# Altium schematic sheet SCHEM_PDB_OFA.SchDoc
size 1651 x 1651 mm; SheetNumber: 1; SheetTotal: 1
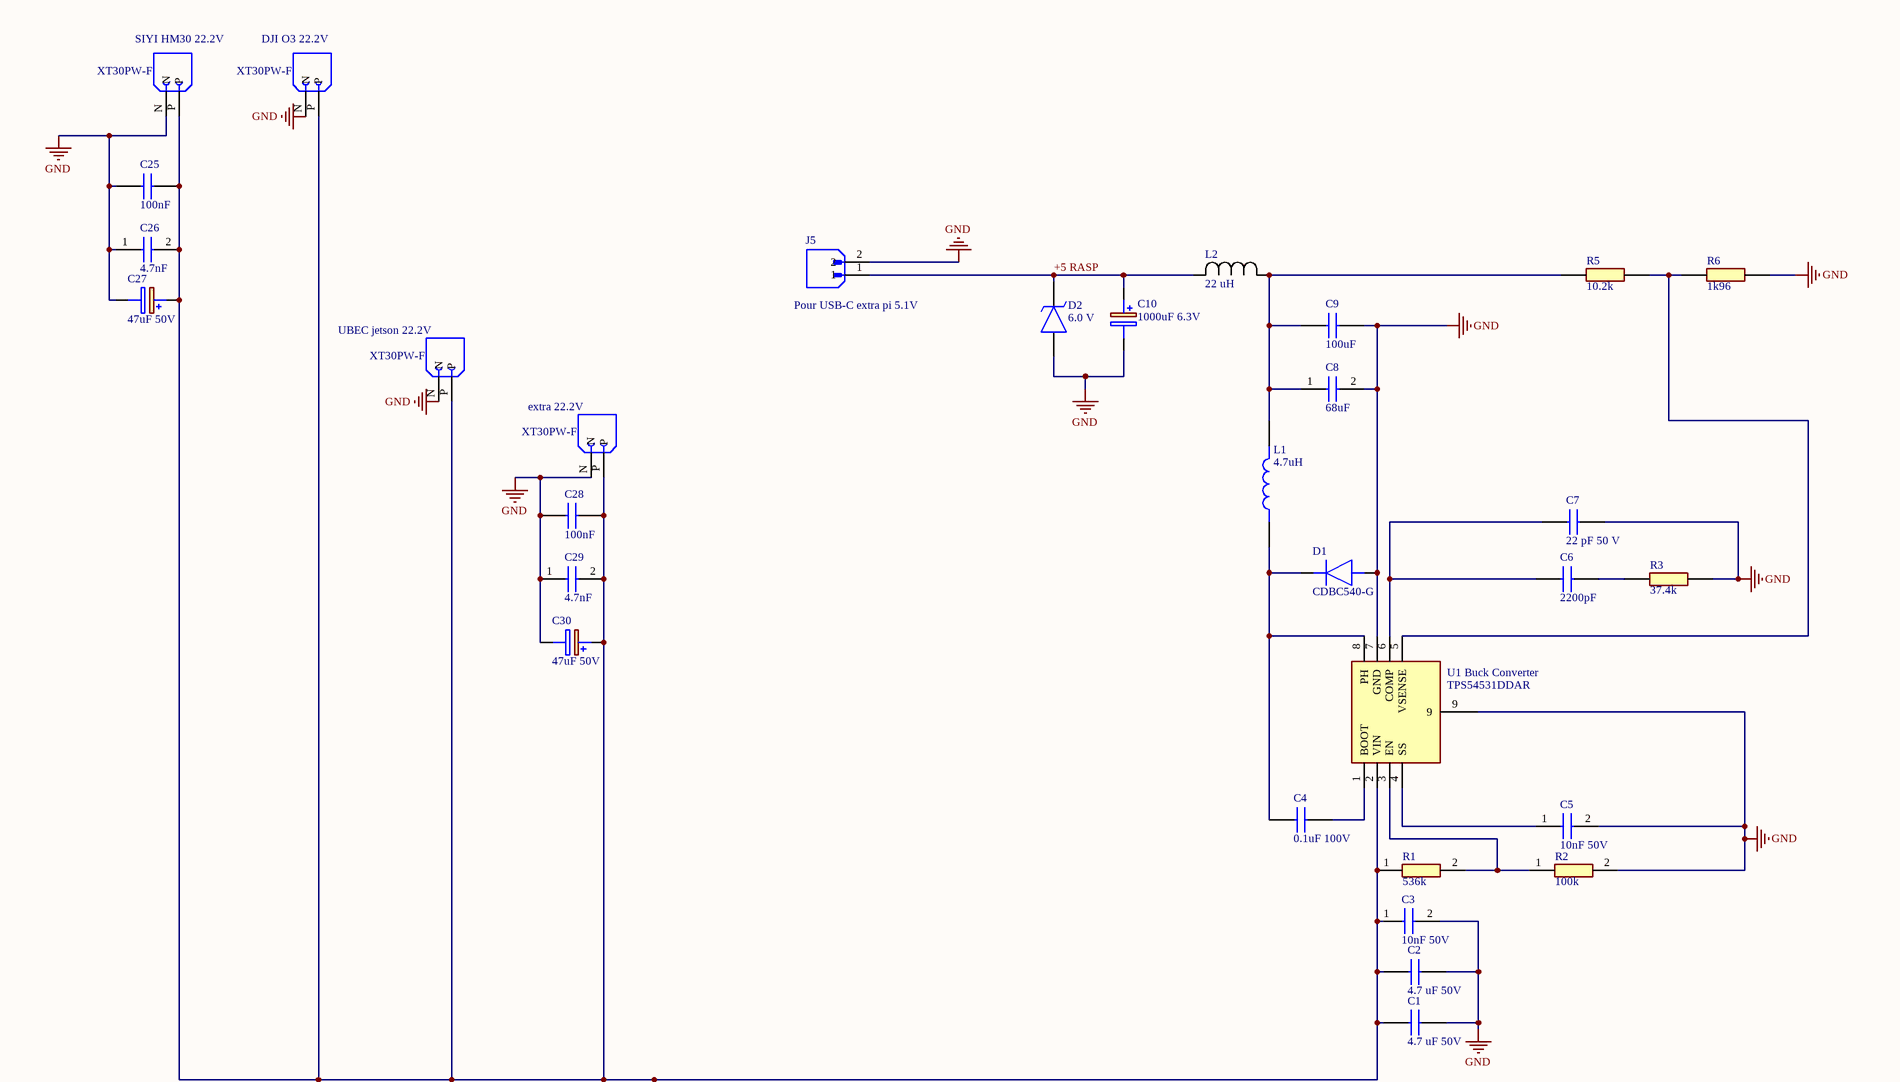
[diagram p0: SCHEM_PDB_OFA.SchDoc, top left]
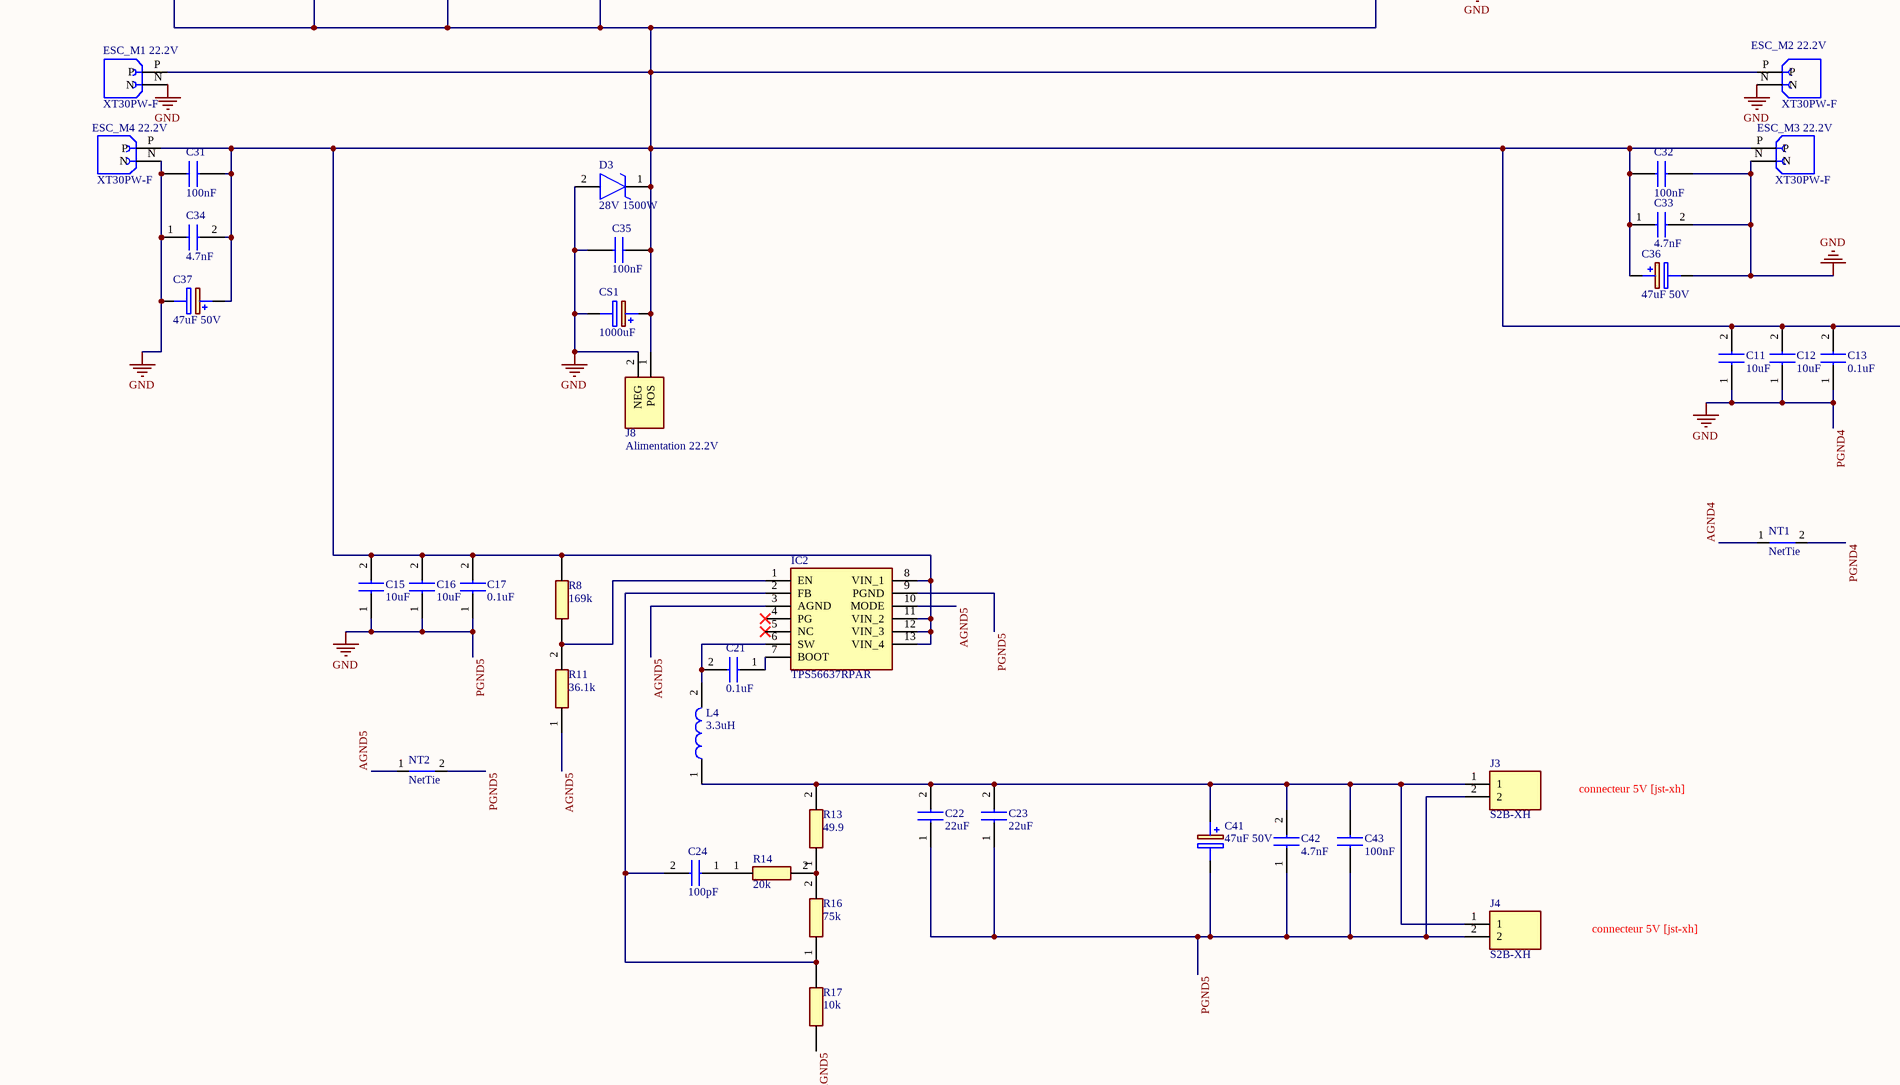
[diagram p1: SCHEM_PDB_OFA.SchDoc, bottom left]
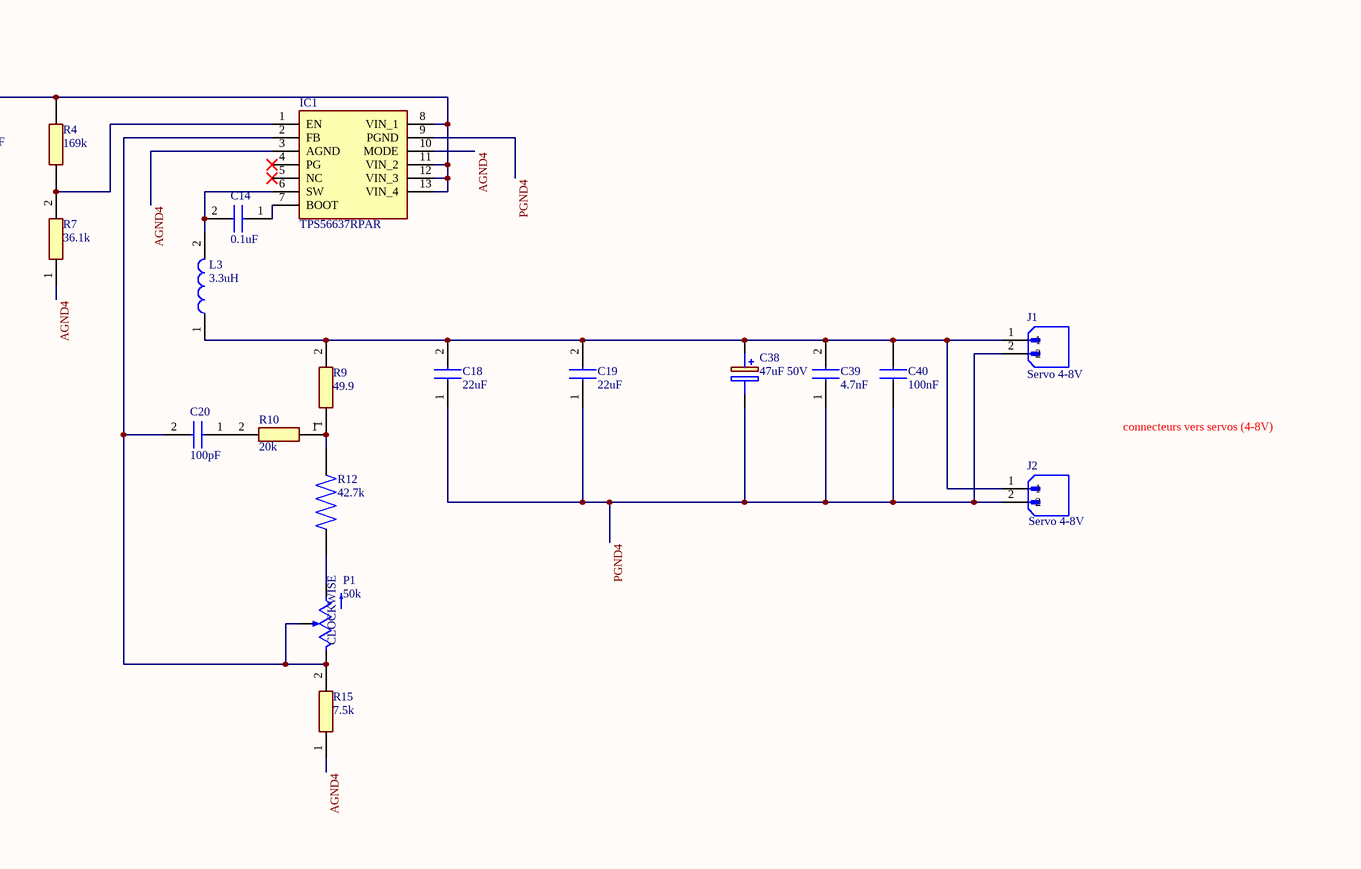
[diagram p2: SCHEM_PDB_OFA.SchDoc, bottom right]

## Parts
C1  4.7 uF 50V  [CAPC2012X145N]
C2  4.7 uF 50V  [CAPC2012X145N]
C3  10nF 50V  [CAPC1608X90N]
C4  0.1uF 100V  [CAPC2012X145N]
C5  10nF 50V  [CAPC1608X90N]
C6  2200pF  [CAPC3216X130N]
C7  22 pF 50 V  [CAPC2012X70N]
C8  68uF  [CAPC3216X180N]
C9  100uF  [GRM31x]
C10  1000uF 6.3V  [CAPAE830X1050N]
C11  10uF  [CAPC3225X280N]
C12  10uF  [CAPC3225X280N]
C13  0.1uF  [C0603]
C14  0.1uF  [C0603]
C15  10uF  [CAPC3225X280N]
C16  10uF  [CAPC3225X280N]
C17  0.1uF  [C0603]
C18  22uF  [CAPC2012X145N]
C19  22uF  [CAPC2012X145N]
C20  100pF  [GRM1885C1H101JA01D]
C21  0.1uF  [C0603]
C22  22uF  [CAPC2012X145N]
C23  22uF  [CAPC2012X145N]
C24  100pF  [GRM1885C1H101JA01D]
C25  100nF  [C1206]
C26  4.7nF  [C1206]
C27  47uF 50V  [CAPPRD250W50D655H1250]
C28  100nF  [C1206]
C29  4.7nF  [C1206]
C30  47uF 50V  [CAPPRD250W50D655H1250]
C31  100nF  [C1206]
C32  100nF  [C1206]
C33  4.7nF  [C1206]
C34  4.7nF  [C1206]
C35  100nF  [C1206]
C36  47uF 50V  [CAPPRD250W50D655H1250]
C37  47uF 50V  [CAPPRD250W50D655H1250]
C38  47uF 50V  [CAPPRD250W50D655H1250]
C39  4.7nF  [C1206]
C40  100nF  [C1206]
C41  47uF 50V  [CAPPRD250W50D655H1250]
C42  4.7nF  [C1206]
C43  100nF  [C1206]
CS1  1000uF  [CAPPRD500W60D1025H2150]
D1  CDBC540-G  [DIOM8059X290N]
D2  6.0 V  [SMBJ12A]
D3  28V 1500W  [DIOM7959X262N]
DJI_O3_22.2V  XT30PW-F  [AMASS_XT30PW-F]
ESC_M1_22.2V  XT30PW-F  [AMASS_XT30PW-F]
ESC_M2_22.2V  XT30PW-F  [AMASS_XT30PW-F]
ESC_M3_22.2V  XT30PW-F  [AMASS_XT30PW-F]
ESC_M4_22.2V  XT30PW-F  [AMASS_XT30PW-F]
extra_22.2V  XT30PW-F  [AMASS_XT30PW-F]
IC1  TPS56637RPAR  [TPS56637RPAR]
IC2  TPS56637RPAR  [TPS56637RPAR]
J1  Servo 4-8V  [JST_B2PS-VH_(LF)(SN)]
J2  Servo 4-8V  [JST_B2PS-VH_(LF)(SN)]
J3  S2B-XH  [S2BXHA1LFSN]
J4  S2B-XH  [S2BXHA1LFSN]
J5  Pour USB-C extra pi 5.1V  [JST_B2PS-VH_(LF)(SN)]
J8  Alimentation 22.2V  [AMASS_XT60PW-M]
L1  4.7uH  [IND_ECS-MPIL0530-4R7MC]
L2  22 uH  [IND_104CDMCCDS_SUM]
L3  3.3uH  [INDM3225X240N]
L4  3.3uH  [INDM3225X240N]
NT1  NetTie  [NetTie]  (net tie, no BOM)
NT2  NetTie  [NetTie]  (net tie, no BOM)
P1  50k  [TRIM_3361P-1-503GLF]
R1  536k  [ERA6AEB101V]
R2  100k  [RESC3216X71N]
R3  37.4k  [RESC2012X50N]
R4  169k  [RESC2012X50N]
R5  10.2k  [RESC2012X50N]
R6  1k96  [RESC2012X50N]
R7  36.1k  [RESC1608X51N]
R8  169k  [RESC2012X50N]
R9  49.9  [RESC3016X65N]
R10  20k  [RESC2012X60N]
R11  36.1k  [RESC1608X51N]
R12  42.7k  [RESC2012X60N]
R13  49.9  [RESC3016X65N]
R14  20k  [RESC2012X60N]
R15  7.5k  [RESC1608X55N]
R16  75k  [RESC3216X75N]
R17  10k  [RESC2012X60N]
SIYI_HM30_22.2V  XT30PW-F  [AMASS_XT30PW-F]
U1_Buck_Converter  TPS54531DDAR  [SOIC127P600X175-8N]
UBEC_jetson_22.2V  XT30PW-F  [AMASS_XT30PW-F]

## Nets
PGND4: C1.1 C2.1 C3.2 C5.2 C7.2 C8.2 C9.2 C10.2(-) C11.1 C12.1 C13.1 C15.1 C16.1 C17.1 C18.1 C19.1 C22.1 C23.1 C25.1 C26.1 C27.2(-) C28.1 C29.1 C30.2(-) C31.1 C32.2 C33.2 C34.1 C35.1 C36.2(-) C37.2(-) C38.2(-) C39.1 C40.1 C41.2(-) C42.1 C43.1 CS1.2(-) D1.2(A) D2.2(A) D3.2(A) DJI_O3_22.2V.N ESC_M1_22.2V.N ESC_M2_22.2V.N ESC_M3_22.2V.N ESC_M4_22.2V.N extra_22.2V.N IC1.9(PGND) IC2.9(PGND) J1.2 J2.2 J3.2 J4.2 J5.2 J8.2(NEG) NT1.2 NT2.2 R2.2 R3.2 R6.2 SIYI_HM30_22.2V.N U1_Buck_Converter.7(GND) U1_Buck_Converter.9 UBEC_jetson_22.2V.N  [also labelled GND, PGND5]
+5 RASP: C10.1(+) D2.1(K) J5.1 L2.2
AGND4: IC1.3(AGND) IC1.10(MODE) NT1.1 R7.1 R15.1
AGND5: IC2.3(AGND) IC2.10(MODE) NT2.1 R11.1 R17.1
NetC1_2: C1.2 C2.2 C3.1 C11.2 C12.2 C13.2 C15.2 C16.2 C17.2 C25.2 C26.2 C27.1(+) C28.2 C29.2 C30.1(+) C31.2 C32.1 C33.1 C34.2 C35.2 C36.1(+) C37.1(+) CS1.1(+) D3.1(K) DJI_O3_22.2V.P ESC_M1_22.2V.P ESC_M2_22.2V.P ESC_M3_22.2V.P ESC_M4_22.2V.P extra_22.2V.P IC1.8(VIN_1) IC1.11(VIN_2) IC1.12(VIN_3) IC1.13(VIN_4) IC2.8(VIN_1) IC2.11(VIN_2) IC2.12(VIN_3) IC2.13(VIN_4) J8.1(POS) R1.1 R4.2 R8.2 SIYI_HM30_22.2V.P U1_Buck_Converter.2(VIN) UBEC_jetson_22.2V.P
NetC4_1: C4.1 D1.1(K) L1.1 U1_Buck_Converter.8(PH)
NetC4_2: C4.2 U1_Buck_Converter.1(BOOT)
NetC5_1: C5.1 U1_Buck_Converter.4(SS)
NetC6_1: C6.1 C7.1 U1_Buck_Converter.6(COMP)
NetC6_2: C6.2 R3.1
NetC8_1: C8.1 C9.1 L1.2 L2.1 R5.1
NetC14_1: C14.1 IC1.7(BOOT)
NetC14_2: C14.2 IC1.6(SW) L3.2
NetC18_2: C18.2 C19.2 C38.1(+) C39.2 C40.2 J1.1 J2.1 L3.1 R9.2
NetC20_1: C20.1 R10.2
NetC20_2: C20.2 IC1.2(FB) P1.1(CCW) P1.2(WIPER) R15.2
NetC21_1: C21.1 IC2.7(BOOT)
NetC21_2: C21.2 IC2.6(SW) L4.2
NetC22_2: C22.2 C23.2 C41.1(+) C42.2 C43.2 J3.1 J4.1 L4.1 R13.2
NetC24_1: C24.1 R14.1
NetC24_2: C24.2 IC2.2(FB) R16.1 R17.2
NetIC1_1: IC1.1(EN) R4.1 R7.2
NetIC2_1: IC2.1(EN) R8.1 R11.2
NetP1_3: P1.3(CW) R12.1
NetR1_2: R1.2 R2.1 U1_Buck_Converter.3(EN)
NetR5_2: R5.2 R6.1 U1_Buck_Converter.5(VSENSE)
NetR9_1: R9.1 R10.1 R12.2
NetR13_1: R13.1 R14.2 R16.2

Not connected (* = marked no-connect by the designer): IC1 4(PG)* 5(NC)*; IC2 4(PG)* 5(NC)*

## Notes on the sheet
- connecteurs vers servos (4-8V)
- connecteur 5V [jst-xh]
- (in symbol TRIM_3361P-1-503GLF) CLOCKWISE

## Library data of the parts
C1 C2 = GRM21BR61H475KE51L: Capacitor; Manufacturer_Name: Murata Electronics; Datasheet Link: https://search.murata.co.jp/Ceramy/image/img/A01X/G101/ENG/GRM21BR61H475KE51-01A.pdf; Height: 1.45mm; Manufacturer_Part_Number: GRM21BR61H475KE51L; Mouser Part Number: 81-GRM21BR61H475KE1L; Mouser Price/Stock: https://www.mouser.co.uk/ProductDetail/Murata-Electronics/GRM21BR61H475KE51L?qs=eeBpzGFlv%252B%252BOtLzDC1PY6Q%3D%3D; Arrow Part Number: GRM21BR61H475KE51L; Arrow Price/Stock: https://www.arrow.com/en/products/grm21br61h475ke51l/murata-manufacturing?region=nac
C3 C5 = CL10B103KB8NNNC: Capacitor; Manufacturer_Name: SAMSUNG; Datasheet Link: https://product.samsungsem.com/mlcc/CL10B103KB8NNN.do; Height: 0.9mm; Manufacturer_Part_Number: CL10B103KB8NNNC; Mouser Part Number: 187-CL10B103KB8NNNC; Mouser Price/Stock: https://www.mouser.co.uk/ProductDetail/Samsung-Electro-Mechanics/CL10B103KB8NNNC?qs=349EhDEZ59pAsZxZjVI0UQ%3D%3D; Arrow Part Number: CL10B103KB8NNNC; Arrow Price/Stock: https://www.arrow.com/en/products/cl10b103kb8nnnc/samsung-electro-mechanics?utm_currency=USD&region=europe
C4 = C2012X7R2A104K125AA: Capacitor; Manufacturer_Name: TDK; Datasheet Link: https://product.tdk.com/info/en/catalog/datasheets/mlcc_commercial_midvoltage_en.pdf; Height: 1.45mm; Manufacturer_Part_Number: C2012X7R2A104K125AA; Mouser Part Number: 810-C2012X7R2A104K; Mouser Price/Stock: https://www.mouser.co.uk/ProductDetail/TDK/C2012X7R2A104K125AA?qs=NRhsANhppD9J0ZsT2%2Fo%2F7Q%3D%3D; Arrow Part Number: C2012X7R2A104K125AA; Arrow Price/Stock: https://www.arrow.com/en/products/c2012x7r2a104k125aa/tdk?region=europe; ClassName: PowerModul
C6 = CGA5H4C0G2J222J115AA: Capacitor 2200pF 630V; Manufacturer_Name: TDK; Datasheet Link: http://docs-europe.electrocomponents.com/webdocs/14e9/0900766b814e9125.pdf; Height: 1.3mm; Manufacturer_Part_Number: CGA5H4C0G2J222J115AA
C7 = CC0805JRNPO9BN220: Capacitor; Manufacturer_Name: YAGEO; Datasheet Link: https://componentsearchengine.com/Datasheets/2/CC0805JRNPO9BN220.pdf; Height: 0.7mm; Manufacturer_Part_Number: CC0805JRNPO9BN220; Mouser Part Number: 603-CC805JRNPO9BN220; Mouser Price/Stock: https://www.mouser.co.uk/ProductDetail/YAGEO/CC0805JRNPO9BN220?qs=vTakOoo5QyK71b5vkghGmg%3D%3D
C8 = C3216X5R0J686M160AB: Capacitor de 68uF; Manufacturer_Name: TDK; Datasheet Link: https://product.tdk.com/info/en/catalog/datasheets/mlcc_commercial_midvoltage_en.pdf; Height: 1.8mm; Manufacturer_Part_Number: C3216X5R0J686M160AB; Mouser Part Number: 810-C3216X5R0J686M1B; Mouser Price/Stock: https://www.mouser.co.uk/ProductDetail/TDK/C3216X5R0J686M160AB?qs=xLDY6iXSiQYzVupG6zVrXw%3D%3D; Arrow Part Number: C3216X5R0J686M160AB; Arrow Price/Stock: https://www.arrow.com/en/products/c3216x5r0j686m160ab/tdk?utm_currency=USD&region=nac
C9 = GRM31CR60J107KEA8L: Capacitor; Manufacturer_Name: Murata Electronics; Datasheet Link: https://search.murata.co.jp/Ceramy/image/img/A01X/G101/ENG/GRM31CR60J107KEA8-01A.pdf; Height: 1.25mm; Manufacturer_Part_Number: GRM31CR60J107KEA8L; Mouser Part Number: 81-GRM31CR60J107KE8L; Mouser Price/Stock: https://www.mouser.co.uk/ProductDetail/Murata-Electronics/GRM31CR60J107KEA8L?qs=pUKx8fyJudDzdyEEakAKPA%3D%3D; Arrow Part Number: GRM31CR60J107KEA8L; Arrow Price/Stock: https://www.arrow.com/en/products/grm31cr60j107kea8l/murata-manufacturing?utm_currency=USD&region=europe
C10 = UCD0J102MNL1GS: Capacitor Polarised; Manufacturer_Name: Nichicon; Datasheet Link: https://www.nichicon.co.jp/english/products/pdfs/e-ucd.pdf; Height: 10.5mm; Manufacturer_Part_Number: UCD0J102MNL1GS; Mouser Part Number: 647-UCD0J102MNL1GS; Mouser Price/Stock: https://www.mouser.co.uk/ProductDetail/Nichicon/UCD0J102MNL1GS?qs=c0uEScvPYN2yS0opD8R0vQ%3D%3D; Arrow Part Number: UCD0J102MNL1GS; Arrow Price/Stock: https://www.arrow.com/en/products/ucd0j102mnl1gs/nichicon
C11 C12 C15 C16 = AGC1210X7R500-106KNE: Capacitor; Manufacturer_Name: Venkel; Datasheet Link: https://data.venkel.com/documents/agc-series?force=1; Height: 2.8mm; Manufacturer_Part_Number: AGC1210X7R500-106KNE
C13 C14 C17 C21 = C0603C104K5RACTU: Capacitor; Manufacturer_Name: KEMET; Datasheet Link: https://content.kemet.com/datasheets/KEM_C1002_X7R_SMD.pdf; Height: 0.87mm; Manufacturer_Part_Number: C0603C104K5RACTU; Mouser Part Number: 80-C0603C104K5R; Mouser Price/Stock: https://www.mouser.co.uk/ProductDetail/KEMET/C0603C104K5RACTU?qs=l5k%252BbMnNDkkVcnZPSAaaiQ%3D%3D; Arrow Part Number: C0603C104K5RACTU; Arrow Price/Stock: https://www.arrow.com/en/products/c0603c104k5ractu/kemet-corporation?utm_currency=USD&region=nac
C18 C19 C22 C23 = C2012X5R1V226M125AC: Capacitor, 35V; Manufacturer_Name: TDK; Datasheet Link: https://product.tdk.com/info/en/catalog/datasheets/mlcc_commercial_midvoltage_en.pdf; Height: 1.45mm; Manufacturer_Part_Number: C2012X5R1V226M125AC; Mouser Part Number: 810-C2012X5R1V226MAC; Mouser Price/Stock: https://www.mouser.co.uk/ProductDetail/TDK/C2012X5R1V226M125AC?qs=6JAMGB%252BEdkyUk0d2Mu2IrQ%3D%3D; Arrow Part Number: C2012X5R1V226M125AC; Arrow Price/Stock: https://www.arrow.com/en/products/c2012x5r1v226m125ac/tdk?utm_currency=USD&region=nac
C20 C24 = GRM1885C1H101JA01D: Capacitor; Manufacturer_Name: Murata Electronics; Datasheet Link: https://search.murata.co.jp/Ceramy/image/img/A01X/G101/ENG/GRM1885C1H101JA01-01A.pdf; Height: 0.9mm; Manufacturer_Part_Number: GRM1885C1H101JA01D; Mouser Part Number: 81-GRM39C101J50; Mouser Price/Stock: https://www.mouser.co.uk/ProductDetail/Murata-Electronics/GRM1885C1H101JA01D?qs=H3lwsW1hsDt1I4guwPQ00A%3D%3D; Arrow Part Number: GRM1885C1H101JA01D; Arrow Price/Stock: https://www.arrow.com/en/products/grm1885c1h101ja01d/murata-manufacturing?utm_currency=USD&region=europe
C25 C28 C31 C32 C35 C40 C43 = C1206C104K1RACTU: Capacitor, 100V max; Manufacturer_Name: KEMET; Datasheet Link: https://content.kemet.com/datasheets/KEM_C1002_X7R_SMD.pdf; Manufacturer_Part_Number: C1206C104K1RACTU; Mouser Part Number: 80-C1206C104K1R; Mouser Price/Stock: https://www.mouser.co.uk/ProductDetail/KEMET/C1206C104K1RACTU?qs=zXJuHl05TF3PSnPdHxXWPA%3D%3D; Arrow Part Number: C1206C104K1RACTU; Arrow Price/Stock: https://www.arrow.com/en/products/c1206c104k1ractu/kemet-corporation?region=nac
C26 C29 C33 C34 C39 C42 = C1206C472K5RACTU: Capacitor, 50V max; Manufacturer_Name: KEMET; Datasheet Link: https://content.kemet.com/datasheets/KEM_C1002_X7R_SMD.pdf; Manufacturer_Part_Number: C1206C472K5RACTU; Mouser Part Number: 80-C1206C472K5R; Mouser Price/Stock: https://www.mouser.co.uk/ProductDetail/KEMET/C1206C472K5RACTU?qs=mFbQsTr%2Fh7%2F0OG5diKY6aA%3D%3D; Arrow Part Number: C1206C472K5RACTU; Arrow Price/Stock: https://www.arrow.com/en/products/c1206c472k5ractu/kemet-corporation?utm_currency=USD&region=nac
C27 C30 C36-C38 C41 = 50YXJ47M6.3X11: Capacitor Polarised, 47uF, 50V; Manufacturer_Name: Rubycon; Datasheet Link: https://www.mouser.co.uk/datasheet/2/977/e_YXJ-1601195.pdf; Height: 12.5mm; Manufacturer_Part_Number: 50YXJ47M6.3X11; Mouser Part Number: 232-50YXJ47M6.3X11; Mouser Price/Stock: https://www.mouser.co.uk/ProductDetail/Rubycon/50YXJ47M6.3X11?qs=T3oQrply3y9Y%2FB9KKPf5JQ%3D%3D
CS1 = 35PX1000MEFC10X20: Capacitor Polarised; Manufacturer_Name: Rubycon; Datasheet Link: https://www.rubycon.co.jp/wp-content/uploads/catalog-aluminum/PX.pdf; Height: 21.5mm; Manufacturer_Part_Number: 35PX1000MEFC10X20; Mouser Part Number: 232-35PX1000MEFC10X2; Mouser Price/Stock: https://www.mouser.co.uk/ProductDetail/Rubycon/35PX1000MEFC10X20?qs=T3oQrply3y86%2F1qnNfO%252BAA%3D%3D; Arrow Part Number: 35PX1000MEFC10X20; Arrow Price/Stock: https://www.arrow.com/en/products/35px1000mefc10x20/rubycon?region=nac
D1 = CDBC540-G: Diode; Manufacturer_Name: Comchip Technology; Datasheet Link: https://eu.mouser.com/datasheet/2/80/CDBC520-HF_Thru195340._CDBC5100-HF_RevB-1480991.pdf; Height: 2.9mm; Manufacturer_Part_Number: CDBC540-G; Mouser Part Number: 750-CDBC540-G; Mouser Price/Stock: https://www.mouser.co.uk/ProductDetail/Comchip-Technology/CDBC540-G?qs=tw%252BuQ%2FB6PO2ExpPYY64Vzw%3D%3D; Arrow Part Number: CDBC540-G; Arrow Price/Stock: https://www.arrow.com/en/products/cdbc540-g/comchip-technology?utm_currency=USD&region=nac
D2 = SMBJ6.0A: TVS Diode (Uni-directional); Manufacturer_Name: STMicroelectronics; Datasheet Link: https://www.st.com/resource/en/datasheet/smbj12a.pdf; Height: 2.45mm; Manufacturer_Part_Number: SMBJ6.0A
D3 = SMCJ28A: TVS Diode, 1500W, 28V; Manufacturer_Name: Bourns; Datasheet Link: https://componentsearchengine.com/Datasheets/2/SMCJ28A.pdf; Height: 2.62mm; Manufacturer_Part_Number: SMCJ28A; Mouser Part Number: 652-SMCJ28A; Mouser Price/Stock: https://www.mouser.co.uk/ProductDetail/Bourns/SMCJ28A?qs=%252Bf8Cd6aE5bxVNvhMry4%2FeQ%3D%3D; Arrow Part Number: SMCJ28A; Arrow Price/Stock: https://www.arrow.com/en/products/smcj28a/bourns?region=nac
DJI_O3_22.2V ESC_M1_22.2V ESC_M2_22.2V ESC_M3_22.2V ESC_M4_22.2V extra_22.2V SIYI_HM30_22.2V UBEC_jetson_22.2V = XT30PW-F: Socket; DC supply; XT30; female; PIN: 2; on PCBs; THT; yellow; 15A; MF: amass; SnapEDA_Link: https://www.snapeda.com/parts/XT30PW-F/AMASS/view-part/?ref=snap; Package: None; Value: *; MP: XT30PW-F; Check_prices: https://www.snapeda.com/parts/XT30PW-F/AMASS/view-part/?ref=eda
IC1 IC2 = TPS56637RPAR: Integrated Circuit; Manufacturer_Name: Texas Instruments; Datasheet Link: https://www.ti.com/lit/gpn/TPS56637; Height: 1mm; Manufacturer_Part_Number: TPS56637RPAR; Mouser Part Number: 595-TPS56637RPAR; Mouser Price/Stock: https://www.mouser.co.uk/ProductDetail/Texas-Instruments/TPS56637RPAR?qs=9r4v7xj2LnkQ0Y9HL0qmSA%3D%3D; Arrow Part Number: TPS56637RPAR; Arrow Price/Stock: https://www.arrow.com/en/products/tps56637rpar/texas-instruments?utm_currency=USD&region=nac
J1 J2 J5 = B2PS-VH_(LF)(SN): Connector Header Through Hole, Right Angle 2 position 0.156 (3.96mm); MF: JST; MP: B2PS-VH (LF)(SN); SnapEDA_Link: https://www.snapeda.com/parts/B2PS-VH%20(LF)(SN)/JST/view-part/?ref=snap; Package: None; Value: *; Check_prices: https://www.snapeda.com/parts/B2PS-VH%20(LF)(SN)/JST/view-part/?ref=eda
J3 J4 = S2B-XH-A-1_LF__SN_: horizontal 2 pin; Manufacturer_Name: JST (JAPAN SOLDERLESS TERMINALS); Manufacturer_Part_Number: S2B-XH-A-1(LF)(SN); Description: CONN HEADER R/A 2POS 2.5MM; Datasheet Link: http://www.jst-mfg.com/product/pdf/eng/eXH.pdf; Height: 6.1mm; Mouser Part Number: 306-S2BXHA1LFSN; Mouser Price/Stock: https://www.mouser.co.uk/ProductDetail/JST-Commercial/S2B-XH-A-1LFSN?qs=QpmGXVUTftHhNeC%252BPQWeTw%3D%3D
J8 = XT60PW-M: Socket, DC supply, male, PIN: 2; MF: AMASS; Check_prices: https://www.snapeda.com/parts/XT60PW-M/AMASS/view-part/?ref=eda; SnapEDA_Link: https://www.snapeda.com/parts/XT60PW-M/AMASS/view-part/?ref=snap; Price: None; Availability: Not in stock; Package: Package; MP: XT60PW-M; Value: *
L1 = ECS-MPIL0530-4R7MC: 4.7 µH Shielded Molded Inductor 5 A 60mOhm Max Nonstandard -; MF: ECS Inc.; SnapEDA_Link: https://www.snapeda.com/parts/ECS-MPIL0530-4R7MC/ECS/view-part/?ref=snap; Package: ECS-MPIL0530-0-2 ECS; Value: *; MP: ECS-MPIL0530-4R7MC; Check_prices: https://www.snapeda.com/parts/ECS-MPIL0530-4R7MC/ECS/view-part/?ref=eda
L2 = 104CDMCCDS-220MC: Bobine de 22 uH, 5 A; Manufacturer_Name: Sumida; Type: Fixed Inductors; Copyright: Copyright (C) 2025 Ultra Librarian. All rights reserved.; Manufacturer_Part_Number: 104CDMCCDS-220MC; ComponentLink1Description: Datasheet; ComponentLink1URL: https://products.sumida.com/products/pdf/104CDMCCDS.pdf
L3 L4 = NLV32T-3R3J-EF: Inductor; Manufacturer_Name: TDK; Datasheet Link: https://product.tdk.com/system/files/dam/doc/product/inductor/inductor/smd/catalog/inductor_commercial_standard_nlv32-ef_en.pdf; Height: 2.4mm; Manufacturer_Part_Number: NLV32T-3R3J-EF
NT1 NT2 = NetTie: Net Tie
P1 = TRIM_3361P-1-503GLF: Potentiometer 50k ohms; ComponentLink1Description: Manufacturer Link; ComponentLink1URL: https://www.digikey.ca/en/products/detail/bourns-inc/3361P-1-503GLF/1088375
R1 = ERA-6AEB5363V: Resistor; Manufacturer_Name: Panasonic; Manufacturer_Part_Number: ERA6AEB5363V; Datasheet Link: https://industrial.panasonic.com/cdbs/www-data/pdf/RDM0000/AOA0000C307.pdf; Height: 0.6mm
R2 = TNPW1206100KBEEA: Resistor; Manufacturer_Name: Vishay; Datasheet Link: http://componentsearchengine.com/Datasheets/1/TNPW1206100KBEEA.pdf; Manufacturer_Part_Number: TNPW1206100KBEEA; Mouser Part Number: 71-TNPW1206100KBEEA; Mouser Price/Stock: https://www.mouser.co.uk/ProductDetail/Vishay-Dale/TNPW1206100KBEEA?qs=3e%2FgEgHITqD1A8tWsKQhKA%3D%3D; Arrow Part Number: TNPW1206100KBEEA; Arrow Price/Stock: https://www.arrow.com/en/products/tnpw1206100kbeea/vishay
R3 = CRCW080537K4FKEA: Resistor; Manufacturer_Name: Vishay; Datasheet Link: http://www.vishay.com/docs/20035/dcrcwe3.pdf; Height: 0.5mm; Manufacturer_Part_Number: CRCW080537K4FKEA; Mouser Part Number: 71-CRCW0805-37.4K-E3; Mouser Price/Stock: https://www.mouser.co.uk/ProductDetail/Vishay-Dale/CRCW080537K4FKEA?qs=ofC1ORbyWJfwcxfoRR0MKw%3D%3D
R4 R6 R8 = CRCW08051K96FKEA: Resistor; Manufacturer_Name: Vishay; Datasheet Link: http://www.vishay.com/docs/20035/dcrcwe3.pdf; Height: 0.5mm; Manufacturer_Part_Number: CRCW08051K96FKEA; Mouser Part Number: 71-CRCW08051K96FKEA; Mouser Price/Stock: https://www.mouser.co.uk/ProductDetail/Vishay-Dale/CRCW08051K96FKEA?qs=1CkV0QOCgMpA%2F6GTgXIN%2Fg%3D%3D; Arrow Part Number: CRCW08051K96FKEA; Arrow Price/Stock: https://www.arrow.com/en/products/crcw08051k96fkea/vishay?region=nac
R5 = CRCW080510K2FKEA: Resistor; Manufacturer_Name: Vishay; Datasheet Link: http://www.vishay.com/docs/20035/dcrcwe3.pdf; Height: 0.5mm; Manufacturer_Part_Number: CRCW080510K2FKEA; Mouser Part Number: 71-CRCW0805-10.2K-E3; Mouser Price/Stock: https://www.mouser.co.uk/ProductDetail/Vishay-Dale/CRCW080510K2FKEA?qs=LOX6nxTstibTXRK16X5NEQ%3D%3D; Arrow Part Number: CRCW080510K2FKEA; Arrow Price/Stock: https://www.arrow.com/en/products/crcw080510k2fkea/vishay?region=nac
R7 R11 = PTN0603E3612BST1: Resistor; Manufacturer_Name: Vishay; Datasheet Link: http://www.vishay.com/docs/60026/ptn.pdf; Height: 0.508mm; Manufacturer_Part_Number: PTN0603E3612BST1
R9 R13 = RNCF1206TKY49R9: Resistor; Manufacturer_Name: Stackpole Electronics; Datasheet Link: https://www.seielect.com/catalog/sei-rncf.pdf; Height: 0.65mm; Manufacturer_Part_Number: RNCF1206TKY49R9; Mouser Part Number: 708-RNCF1206TKY49R9; Mouser Price/Stock: https://www.mouser.co.uk/ProductDetail/SEI-Stackpole/RNCF1206TKY49R9?qs=IPgv5n7u5QbrkyDMq71eTQ%3D%3D; Arrow Part Number: RNCF1206TKY49R9; Arrow Price/Stock: https://www.arrow.com/en/products/rncf1206tky49r9/stackpole-electronics?region=nac
R10 R14 = RK73H2ATTD2002F: Resistor; Manufacturer_Name: KOA Speer; Datasheet Link: http://www.koaspeer.com/catimages/Products/RK73H/RK73H.pdf; Height: 0.6mm; Manufacturer_Part_Number: RK73H2ATTD2002F; Mouser Part Number: 660-RK73H2ATTD2002F; Mouser Price/Stock: https://www.mouser.com/Search/Refine.aspx?Keyword=660-RK73H2ATTD2002F
R12 = RN73R2ATTD4272D25: Package: None; Price: None; Value: *; MP: RN73R2ATTD4272D25; Availability: Unavailable
R15 = RC0603FR-077K5L: Resistor; Manufacturer_Name: KEMET; Datasheet Link: http://www.yageo.com/documents/recent/PYu-RC0603_51_RoHS_L_v5.pdf; Height: 0.55mm; Manufacturer_Part_Number: RC0603FR-077K5L; Mouser Part Number: 603-RC0603FR-077K5L; Mouser Price/Stock: https://www.mouser.co.uk/ProductDetail/Yageo/RC0603FR-077K5L/?qs=2cAdsCoAWREF%252BylA0TXaCQ%3D%3D
R16 = CR1206-FX-7502ELF: Resistor; Manufacturer_Name: Bourns; Datasheet Link: http://www.bourns.com/data/global/pdfs/CHPREZTR.pdf; Height: 0.75mm; Manufacturer_Part_Number: CR1206-FX-7502ELF; Mouser Part Number: 652-CR1206FX-7502ELF; Mouser Price/Stock: https://www.mouser.co.uk/ProductDetail/Bourns/CR1206-FX-7502ELF?qs=x5wsLs3ZZ83CFlrcVX0CWw%3D%3D
R17 = CRCW080510K0FKEAHP: Resistor; Manufacturer_Name: Vishay; Datasheet Link: https://componentsearchengine.com/Datasheets/1/CRCW08051R00FKEAHP.pdf; Height: 0.6mm; Manufacturer_Part_Number: CRCW080510K0FKEAHP; Mouser Part Number: 71-CRCW080510K0FKEAH; Mouser Price/Stock: https://www.mouser.co.uk/ProductDetail/Vishay-Dale/CRCW080510K0FKEAHP?qs=FlFvgi4rxBybVOW6oiRQjA%3D%3D; Arrow Part Number: CRCW080510K0FKEAHP; Arrow Price/Stock: https://www.arrow.com/en/products/crcw080510k0fkeahp/vishay?utm_currency=USD&region=europe; ClassName: PowerModul
U1_Buck_Converter = TPS54531DDAR: Power Supply; Manufacturer_Name: Texas Instruments; Datasheet Link: http://www.ti.com/lit/gpn/tps54531; Height: 1.7mm; Manufacturer_Part_Number: TPS54531DDAR; Mouser Part Number: 595-TPS54531DDAR; Mouser Price/Stock: https://www.mouser.co.uk/ProductDetail/Texas-Instruments/TPS54531DDAR?qs=jA5Ki6243onykODzUePbag%3D%3D; Arrow Part Number: TPS54531DDAR; Arrow Price/Stock: https://www.arrow.com/en/products/tps54531ddar/texas-instruments?utm_currency=USD&region=nac